# Altium schematic sheet Sheet1.SchDoc
size Letter; SheetNumber: 1; SheetTotal: 1; SPICEModelCacheYVTIARTH: <root> / <DocumentId>YVTIARTH</DocumentId> / <CacheFrame Number="0"> / <Model Name="dpsw2" Kind="CKT"> / <Text>* DIP switch 2 / * jjt 19/6/2002: created / * / *             Switch connections: / *             sw1 / *             |  |  sw2 / *             |  |  |  | / *             |  |  |  | / .subckt dpsw2 1  2  4  5 / + PARAMS: STATE1=0 STATE2=0 RON=1m ROFF=100E6 / * / V1 3 0 {STATE1} / V2 6 0 {STATE2} / * / SDIP1 1 2 3 0 DIPMOD / SDIP2 4 5 6 0 DIPMOD / * / .MODEL DIPMOD SW(VT=0.5 RON={RON} ROFF={ROFF}) / .ends dpsw2</Text> / </Model> / </CacheFrame> / </root>
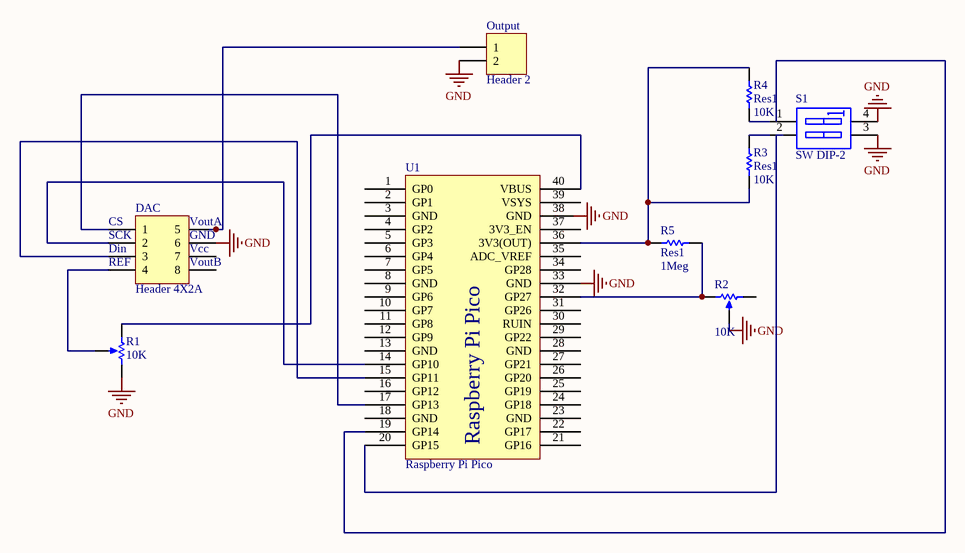
[diagram p0: Sheet1.SchDoc]

## Parts
DAC  Header 4X2A  [HDR2X4_CEN]
Output  Header 2  [HDR1X2]
R1  value 10K  [POT OFFSET 200]  (hidden comment: RPot_3)
R2  value 10K  [POT OFFSET 200]  (hidden comment: RPot_3)
R3  Res1  value 10K  [AXIAL-0.3]
R4  Res1  value 10K  [AXIAL-0.3]
R5  Res1  value 1Meg  [AXIAL-0.3]
S1  SW DIP-2  [DIP-4]
U1  Raspberry Pi Pico  [Raspberry Pi Pico]

## Nets
GND: DAC.6 Output.2 R1.3(BOT) R2.2(TAP) S1.3(B2) S1.4(B1) U1.33(GND)
NetDAC_1: DAC.1 U1.17(GP13)
NetDAC_2: DAC.2 U1.14(GP10)
NetDAC_3: DAC.3 U1.15(GP11)
NetDAC_4: DAC.4 R1.2(TAP)
NetDAC_5: DAC.5 Output.1
NetR1_1: R1.1(TOP) U1.40(VBUS)
NetR2_1: R2.1(TOP) R5.2 U1.32(GP27)
NetR3_1: R3.1 S1.2(A2)
NetR3_2: R3.2 R4.1 R5.1 U1.36(3V3(OUT))
NetR4_2: R4.2 S1.1(A1)

Not connected (* = marked no-connect by the designer): DAC 7 8; R2 3(BOT); U1 1(GP0) 2(GP1) 3(GND) 4(GP2) 5(GP3) 6(GP4) 7(GP5) 8(GND) 9(GP6) 10(GP7) 11(GP8) 12(GP9) 13(GND) 16(GP12) 18(GND) 19(GP14) 20(GP15) 21(GP16) 22(GP17) 23(GND) 24(GP18) 25(GP19) 26(GP20) 27(GP21) 28(GND) 29(GP22) 30(RUIN) 31(GP26) 34(GP28) 35(ADC_VREF) 37(3V3_EN) 38(GND) 39(VSYS)

## Notes on the sheet
- (near DAC) CS
- (near DAC) SCK
- (near DAC) VoutA
- (near DAC) GND
- (near DAC) Din
- (near DAC) REF
- (near DAC) Vcc
- (near DAC) VoutB
- Labels drawn without touching a wire or pin: GND

## Library data of the parts
DAC = Header 4X2A: Header, 4-Pin, Dual row; LatestRevisionDate: 17-Jul-2002; LatestRevisionNote: Re-released for DXP Platform.; Publisher: Altium Limited
Output = Header 2: Header, 2-Pin; LatestRevisionDate: 17-Jul-2002; LatestRevisionNote: Re-released for DXP Platform.; Publisher: Altium Limited
R1 R2 = RPot: Potentiometer; Sim Note: Enter the Resistance value and the set point into parameter fields.; Set Position: 0.5; Published: 8-Jun-2000; LatestRevisionDate: 17-Jul-2002; LatestRevisionNote: Re-released for DXP Platform.; Publisher: Altium Limited
R3-R5 = Res1: Resistor; Published: 8-Jun-2000; LatestRevisionDate: 17-Jul-2002; LatestRevisionNote: Re-released for DXP Platform.; PackageReference: AXIAL-0.3; Publisher: Altium Limited; PackageDescription: Axial Device, Thru-Hole; 2 Leads; 0.3 in Pin Spacing
S1 = SW DIP-2: DIP Switch, 2 Position, SPST; Published: 24-Mar-1999; LatestRevisionDate: 17-Jul-2002; LatestRevisionNote: Re-released for DXP Platform.; PackageReference: DIP-4; Publisher: Altium Limited